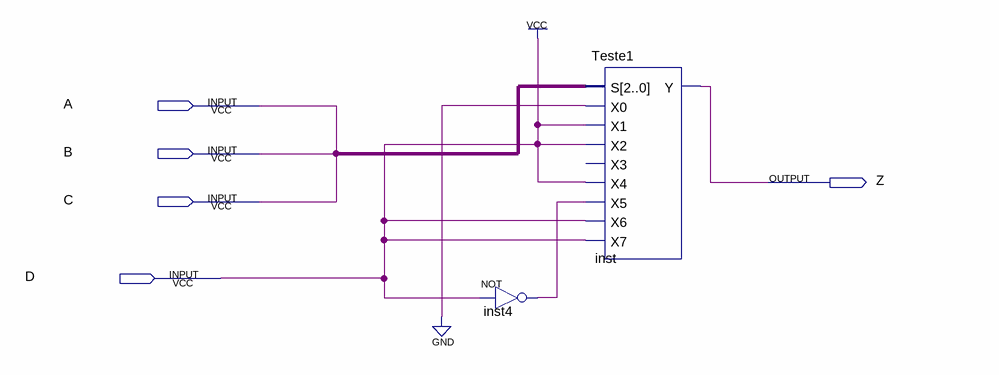
[diagram p0: schematic sheet]
// Quartus schematic Teste1ex3.bdf as structural Verilog: 2 symbols, 5 pins
module Teste1ex3 (
  input  A,
  input  B,
  input  C,
  input  D,
  output Z
);

  wire inst4_out;
  wire [2:0] undriven;

  not inst4 (inst4_out, D);
  Teste1 inst (.S(undriven), .X0(1'b0), .X1(D), .X2(D), .X4(D), .X5(inst4_out), .X6(D), .X7(D), .Y(Z));  // open: X3
  // also tied to VCC on the sheet: D
endmodule
